# EAGLE design CT_Adapter (EAGLE 6.5.0)
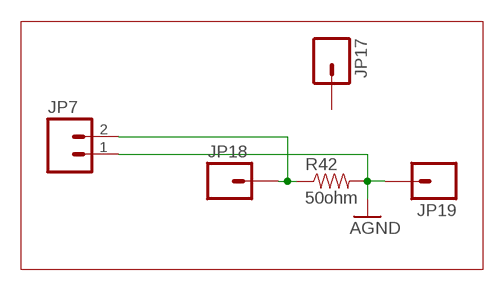
[diagram p0: schematic, sheet 1]

## Parts
JP7  M025MM  [SCREWTERMINAL-5MM-2]
JP17  M01PTH_LONGPAD  [1X01_LONGPAD]
JP18  M01PTH_LONGPAD  [1X01_LONGPAD]
JP19  M01PTH_LONGPAD  [1X01_LONGPAD]
R42  50ohm  RESISTOR1206  [1206]

## Nets
AGND: JP7.1 JP19.1 R42.2
N$2: JP7.2 JP18.1 R42.1
Unconnected: JP17.1

## Library data of the parts
JP7 = SparkFun-Connectors:M02: Standard 2-pin 0.1" header. Use with - straight break away headers ( PRT-00116) - right angle break away headers (PRT-00553) - swiss pins (PRT-00743) - machine pins (PRT-00117) - female headers (PRT-00115) Molex polarized connector foot print use with: PRT-08233 with associated crimp pins and housings. 2.54_SCREWTERM for use with PRT-10571. 3.5mm Screw Terminal footprints for PRT-08084 5mm Screw Terminal footprints for use with PRT-08432; STOREFRONT_ID: PRT-08432
JP17-JP19 = SparkFun-Connectors:M01: Header 1 Standard 1-pin 0.1" header. Use with straight break away headers (SKU : PRT-00116), right angle break away headers (PRT-00553), swiss pins (PRT-00743), machine pins (PRT-00117), and female headers (PRT-00115). SMTSO-256-ET is a "flush mount" nut for a 4-40 screw. The older package used to be too tight, and did not allow it to sit properly thru the drill hit. The latest (0.165DIA) fits nice and snug.
R42 = SparkFun-Passives:RESISTOR: Resistor Basic schematic elements and footprints for 0603, 1206, and PTH resistors.

## Board
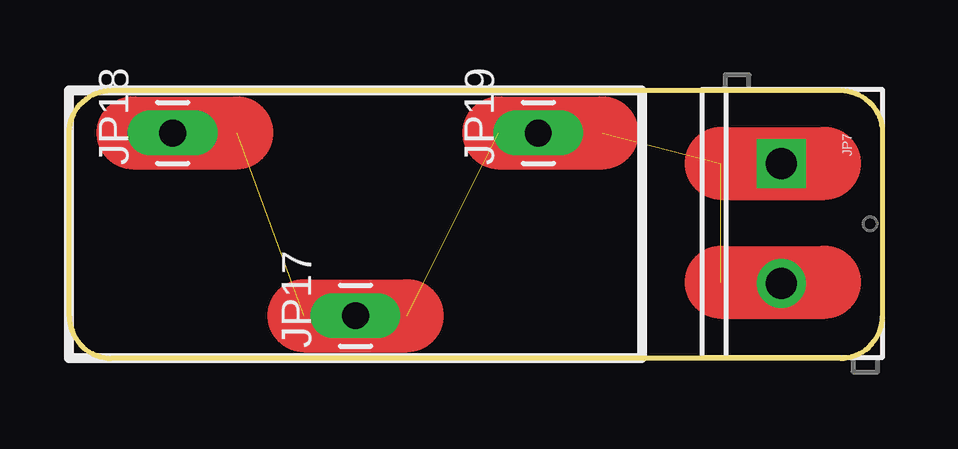
[diagram p1: board, top side]
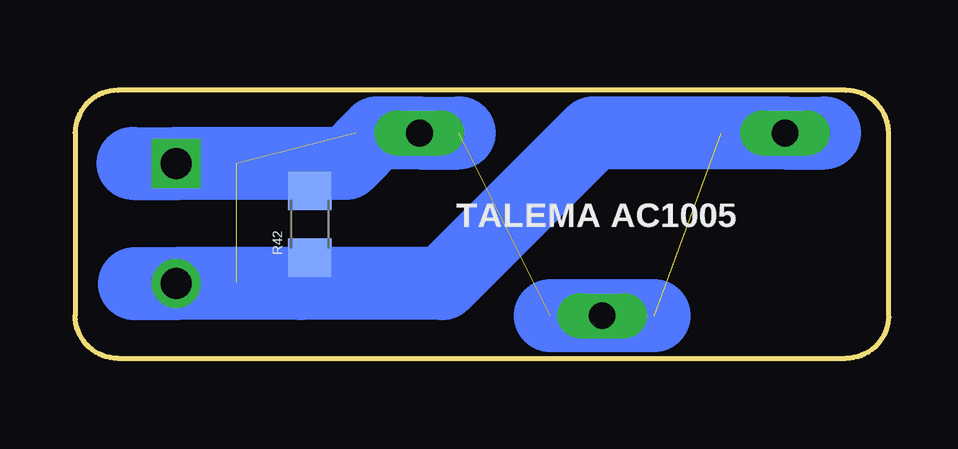
[diagram p2: board, bottom side, seen from below]

Size 33.91 x 11.18 mm. Coordinates in mm from the lower left corner, seen from the top.
Outline: 0,1.78 0,9.4 arc-90 1.78,11.18 32.13,11.18 arc-90 33.91,9.4 33.91,1.78 arc-90 32.13,0 1.78,0 arc-90 0,1.78
Copper layers (1*16): Top 0.035mm / dielectric 1.5mm / Bottom 0.035mm
Design rules "default *": minimum track width 10mil, minimum drill 24mil, track to track 8mil, track to pad 8mil, pad to pad 8mil, via to via 8mil, smd to smd 8mil, copper to edge 40mil, drill to drill 8mil, minimum pad ring 10mil, minimum via ring 8mil, stop-mask expansion 4mil, vias tented up to drill 0mil, thermal gap 10mil
tRestrict: 5 lines

### Footprints (pad centres in the part's own frame; a part is rotated, then mirrored left to right if it is on the bottom)
SCREWTERMINAL-5MM-2 = drill 1.3 pad 2.032 square: 1 0,0 | drill 1.3 pad 2.032: 2 5,0
1X01_LONGPAD = drill 1.118 pad 1.88 long: 1 0,0
1206 = smd 1.6 x 1.8: 1 -1.4,0; 2 1.4,0

### Placement (x,y rotation side)
JP7  29.7,8.12 270 top
JP17  11.94,1.78 90 top
JP18  4.32,9.4 90 top
JP19  19.56,9.4 90 top
R42  24.13,5.59 90 bottom

### Tracks (layer width: path | path; a pad name or v marks a point on that pad's centre or on a via)
AGND
  Bottom 0.356: 24.26,7.5 23.63,8.13 22.61,8.13
  Bottom 1.016: R42.2 24.26,7.5 25.53,8.76
  Bottom 3.048: 17.91,9.4 JP19.1 21.34,9.4 22.61,8.13 JP7.1 | 31.5,8.13 JP7.1 | JP7.1
N$1  (5 unrouted)
  Top 3.048: 27.18,3.17 31.5,3.17 | 2.67,9.4 6.99,9.4 | 9.78,1.78 14.1,1.78 | 17.91,9.4 22.23,9.4 | 27.18,8.13 31.5,8.13
  Bottom 3.048: 9.78,1.78 14.1,1.78
N$2
  Bottom 1.016: R42.1 24.13,3.5 24.51,3.12
  Bottom 3.048: 2.67,9.4 JP18.1 12.32,9.4 18.6,3.12 24.51,3.12 JP7.2 31.44,3.12

### Text on the board
bPlace: TALEMA AC1005